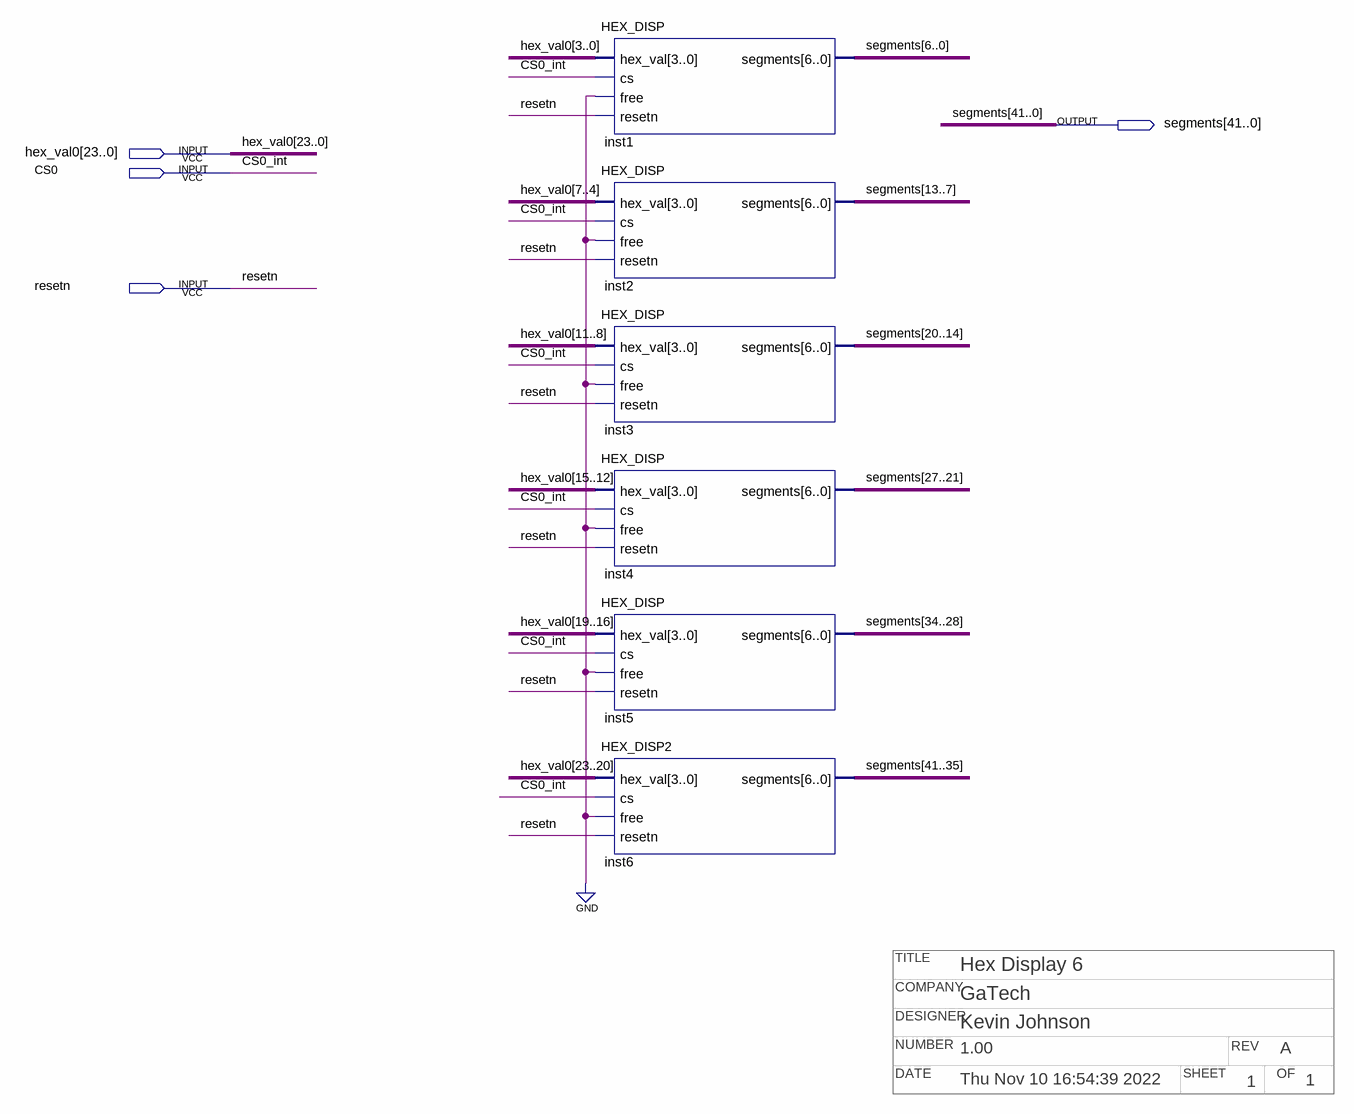
[diagram p0: schematic sheet]
// Quartus schematic HEX_DISPV2_6.bdf as structural Verilog: 6 symbols, 4 pins
// Title block: COMPANY: GaTech; DATE: Thu Nov 10 16:54:39 2022; DESIGNER: Kevin Johnson; NUMBER: 1.00; OF: 1; REV: A; SHEET: 1; TITLE: Hex Display 6
module HEX_DISPV2_6 (
  input  [23:0] hex_val0,
  input  CS0,
  input  resetn,
  output [41:0] segments
);

  HEX_DISP inst1 (.hex_val(hex_val0[3:0]), .cs(CS0), .free(1'b0), .resetn(resetn), .segments(segments[6:0]));
  HEX_DISP inst2 (.hex_val(hex_val0[7:4]), .cs(CS0), .free(1'b0), .resetn(resetn), .segments(segments[13:7]));
  HEX_DISP inst3 (.hex_val(hex_val0[11:8]), .cs(CS0), .free(1'b0), .resetn(resetn), .segments(segments[20:14]));
  HEX_DISP inst4 (.hex_val(hex_val0[15:12]), .cs(CS0), .free(1'b0), .resetn(resetn), .segments(segments[27:21]));
  HEX_DISP inst5 (.hex_val(hex_val0[19:16]), .cs(CS0), .free(1'b0), .resetn(resetn), .segments(segments[34:28]));
  HEX_DISP2 inst6 (.hex_val(hex_val0[23:20]), .cs(CS0), .free(1'b0), .resetn(resetn), .segments(segments[41:35]));

  // Other names for the same wires on the sheet: CS0_int = CS0
endmodule
